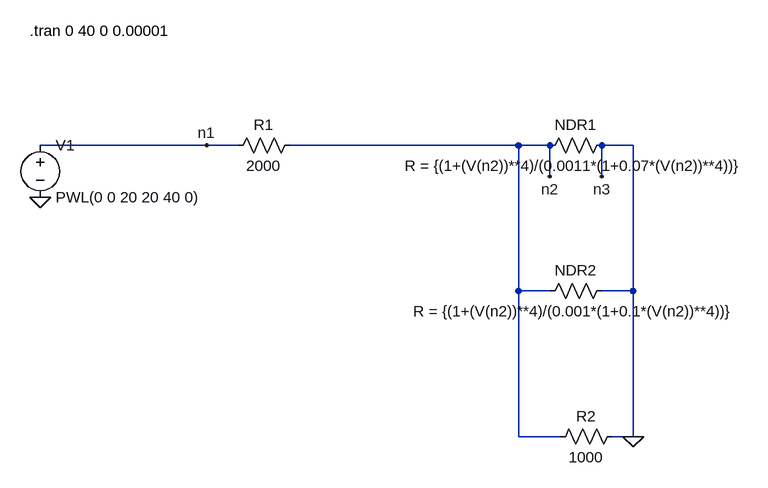
[diagram p0: schematic geo_construct_d.asc]
geo_construct_d.asc, the LTspice schematic file:
Version 4
SHEET 1 1476 680
WIRE 544 -320 288 -320
WIRE 592 -320 544 -320
WIRE 1024 -320 672 -320
WIRE 1072 -320 1024 -320
WIRE 1200 -320 1152 -320
WIRE 1072 -272 1072 -320
WIRE 1152 -272 1152 -320
WIRE 1024 -96 1024 -320
WIRE 1072 -96 1024 -96
WIRE 1200 -96 1200 -320
WIRE 1200 -96 1152 -96
WIRE 1024 128 1024 -96
WIRE 1088 128 1024 128
WIRE 1200 128 1200 -96
WIRE 1200 128 1168 128
FLAG 288 -240 0
FLAG 1072 -272 n2
FLAG 1152 -272 n3
FLAG 544 -320 n1
FLAG 1200 128 0
SYMBOL res 1056 -304 R270
WINDOW 0 32 56 VTop 2
WINDOW 3 0 56 VBottom 2
SYMATTR InstName NDR1
SYMATTR Value R = {(1+(V(n2))**4)/(0.0011*(1+0.07*(V(n2))**4))}
SYMBOL res 1056 -80 R270
WINDOW 0 32 56 VTop 2
WINDOW 3 0 56 VBottom 2
SYMATTR InstName NDR2
SYMATTR Value R = {(1+(V(n2))**4)/(0.001*(1+0.1*(V(n2))**4))}
SYMBOL voltage 288 -336 R0
WINDOW 123 0 0 Left 0
WINDOW 39 0 0 Left 0
SYMATTR InstName V1
SYMATTR Value PWL(0 0 20 20 40 0)
SYMBOL res 576 -304 R270
WINDOW 0 32 56 VTop 2
WINDOW 3 0 56 VBottom 2
SYMATTR InstName R1
SYMATTR Value 2000
SYMBOL res 1072 144 R270
WINDOW 0 32 56 VTop 2
WINDOW 3 0 56 VBottom 2
SYMATTR InstName R2
SYMATTR Value 1000
TEXT 272 -496 Left 2 !.tran 0 40 0 0.00001

The netlist it stands for:
* geo_construct_d.asc
R§NDR1 n2 0 R = {(1+(V(n2))**4)/(0.0011*(1+0.07*(V(n2))**4))}
R§NDR2 n2 0 R = {(1+(V(n2))**4)/(0.001*(1+0.1*(V(n2))**4))}
V1 n1 0 PWL(0 0 20 20 40 0)
R1 n1 n2 2000
R2 n2 0 1000
.tran 0 40 0 0.00001
.backanno
.end